# EAGLE design atmega16-128 (EAGLE 9.0.1)
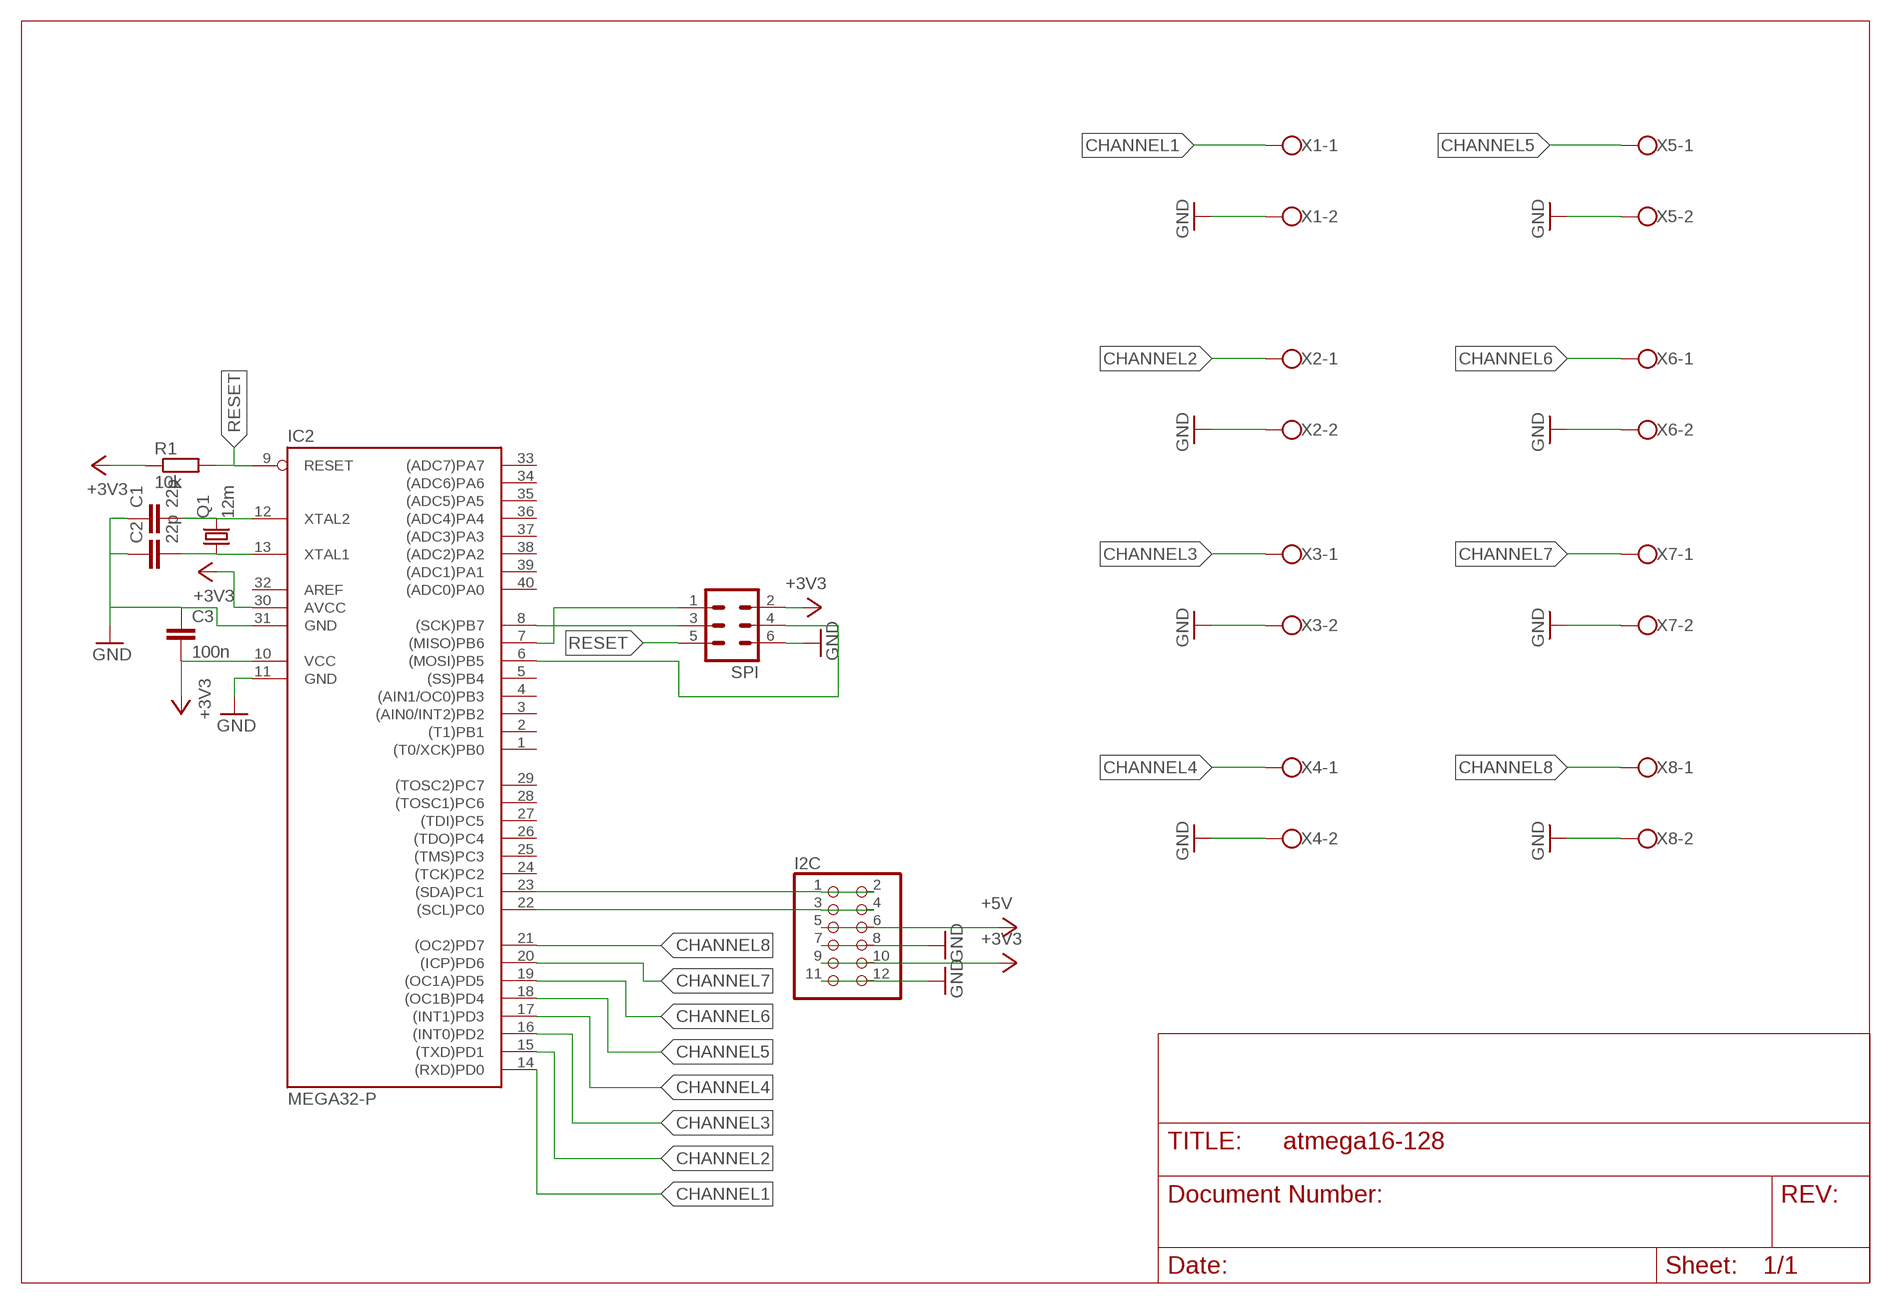
[diagram p0: schematic, sheet 1]

## Parts
C1  22p  C-EU025-025X050  [C025-025X050]
C2  22p  C-EU025-025X050  [C025-025X050]
C3  100n  C-EU025-025X050  [C025-025X050]
I2C  PINHD-2X6  [2X06]
IC2  MEGA32-P  [DIL40]
Q1  12m  CRYSTALHC49S  [HC49/S]
R1  10k  R-EU_0207/10  [0207/10]
SPI  ML6  [ML6]
X1  W237-102  [W237-102]
X2  W237-102  [W237-102]
X3  W237-102  [W237-102]
X4  W237-102  [W237-102]
X5  W237-102  [W237-102]
X6  W237-102  [W237-102]
X7  W237-102  [W237-102]
X8  W237-102  [W237-102]

## Nets
+3V3: C3.2 I2C.9 I2C.10 IC2.10(VCC) IC2.30(AVCC) R1.1 SPI.2
+5V: I2C.5 I2C.6
CHANNEL1: IC2.14((RXD)PD0) X1.1
CHANNEL2: IC2.15((TXD)PD1) X2.1
CHANNEL3: IC2.16((INT0)PD2) X3.1
CHANNEL4: IC2.17((INT1)PD3) X4.1
CHANNEL5: IC2.18((OC1B)PD4) X5.1
CHANNEL6: IC2.19((OC1A)PD5) X6.1
CHANNEL7: IC2.20((ICP)PD6) X7.1
CHANNEL8: IC2.21((OC2)PD7) X8.1
GND: C1.1 C2.1 C3.1 I2C.7 I2C.8 I2C.11 I2C.12 IC2.11(GND) IC2.31(GND) SPI.6 X1.2 X2.2 X3.2 X4.2 X5.2 X6.2 X7.2 X8.2
IO14: IC2.6((MOSI)PB5) SPI.4
N$4: IC2.8((SCK)PB7) SPI.3
N$6: IC2.7((MISO)PB6) SPI.1
RESET: IC2.9(RESET) R1.2 SPI.5
SCL: I2C.3 I2C.4 IC2.22((SCL)PC0)
SDA: I2C.1 I2C.2 IC2.23((SDA)PC1)
XTAL1: C2.2 IC2.13(XTAL1) Q1.1
XTAL2: C1.2 IC2.12(XTAL2) Q1.2
Unconnected: IC2.1((T0/XCK)PB0) IC2.2((T1)PB1) IC2.3((AIN0/INT2)PB2) IC2.4((AIN1/OC0)PB3) IC2.5((SS)PB4) IC2.24((TCK)PC2) IC2.25((TMS)PC3) IC2.26((TDO)PC4) IC2.27((TDI)PC5) IC2.28((TOSC1)PC6) IC2.29((TOSC2)PC7) IC2.32(AREF) IC2.33((ADC7)PA7) IC2.34((ADC6)PA6) IC2.35((ADC5)PA5) IC2.36((ADC4)PA4) IC2.37((ADC3)PA3) IC2.38((ADC2)PA2) IC2.39((ADC1)PA1) IC2.40((ADC0)PA0)

## Library data of the parts
C1-C3 = rcl:C-EU: CAPACITOR, European symbol
I2C = pinhead:PINHD-2X6: PIN HEADER
IC2 = atmel:MEGA32-P: MICROCONTROLLER 32 Kbytes FLASH 2 Kbytes SRAM 1 Kbytes EEPROM USART 8-channel 10 bit ADC Source: www.atmel.com .. doc2503.pdf; MPN: ATMEGA32-16PU; OC_FARNELL: 1661729; OC_NEWARK: 51P1794
Q1 = crystal:CRYSTAL: CRYSTAL; OC_FARNELL: 1667008; OC_NEWARK: unknown
R1 = resistor:R-EU_: RESISTOR, European symbol
SPI = con-ml:ML6: HARTING; OC_FARNELL: unknown; OC_NEWARK: unknown
X1-X8 = con-wago-500:W237-102: WAGO SCREW CLAMP; MPN: 237-102; OC_FARNELL: unknown; OC_NEWARK: 70K9898

## Board
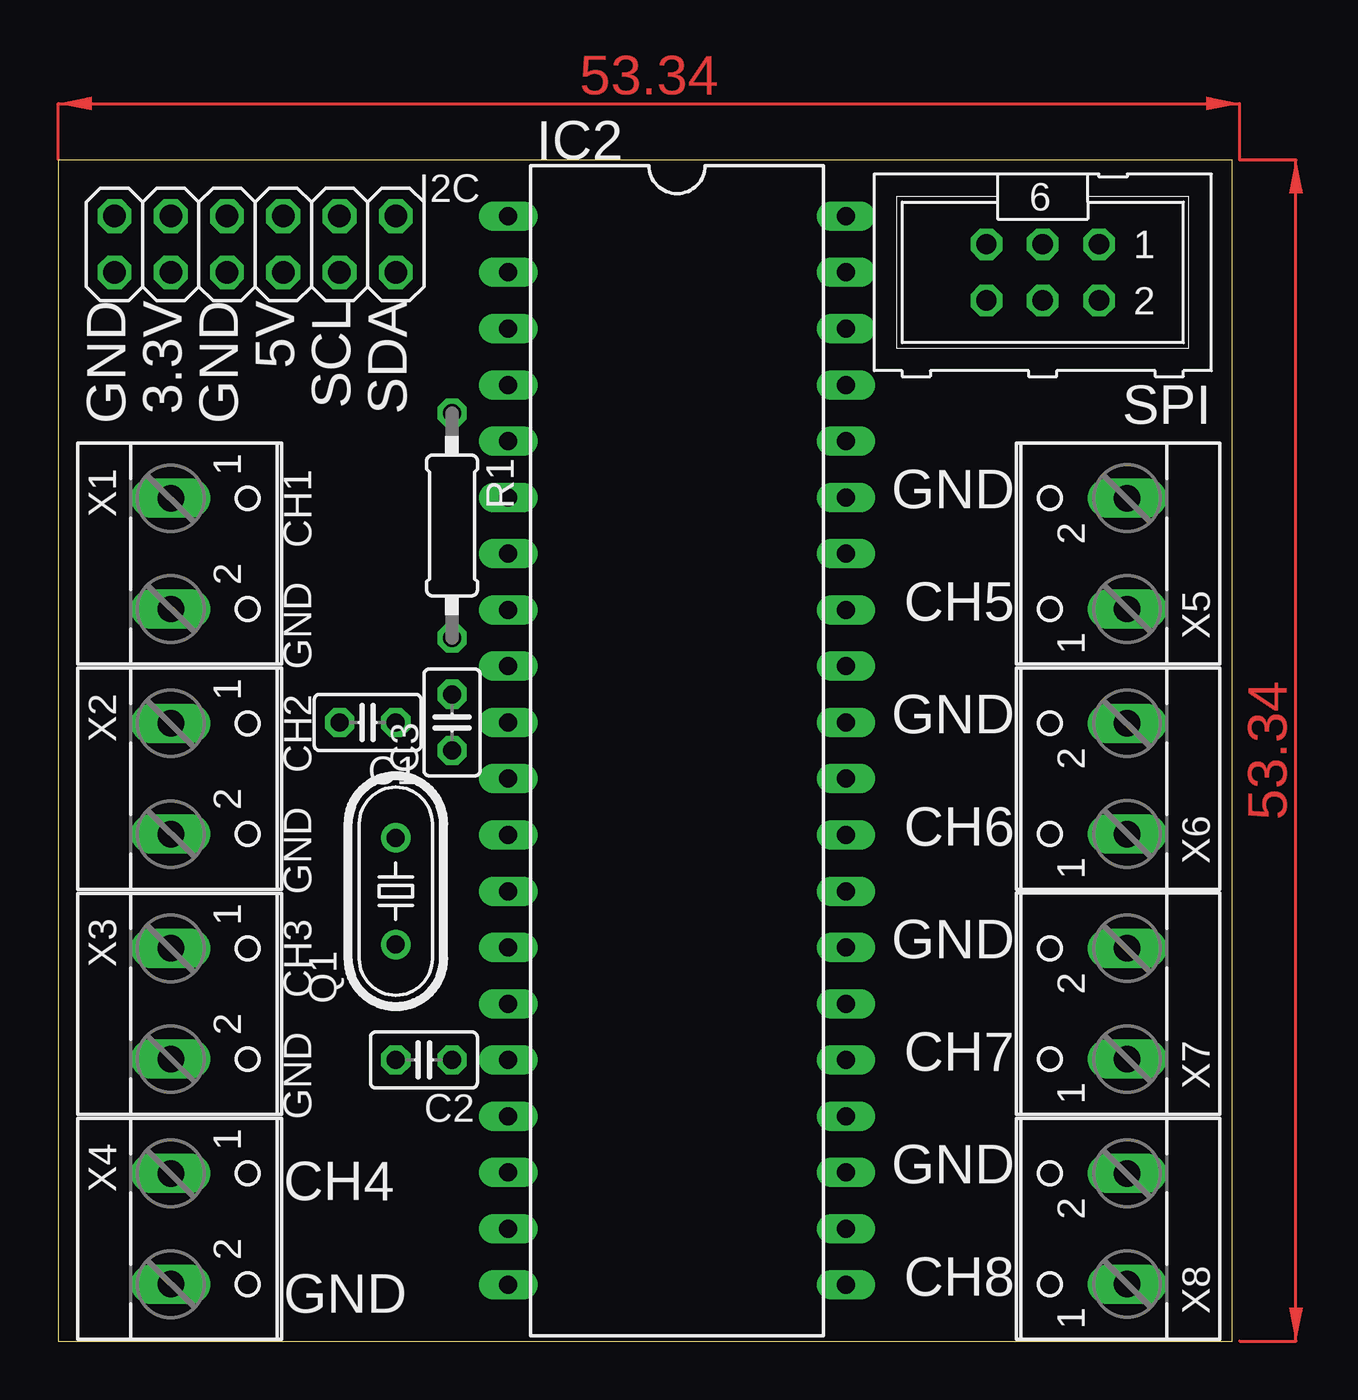
[diagram p1: board, top side]
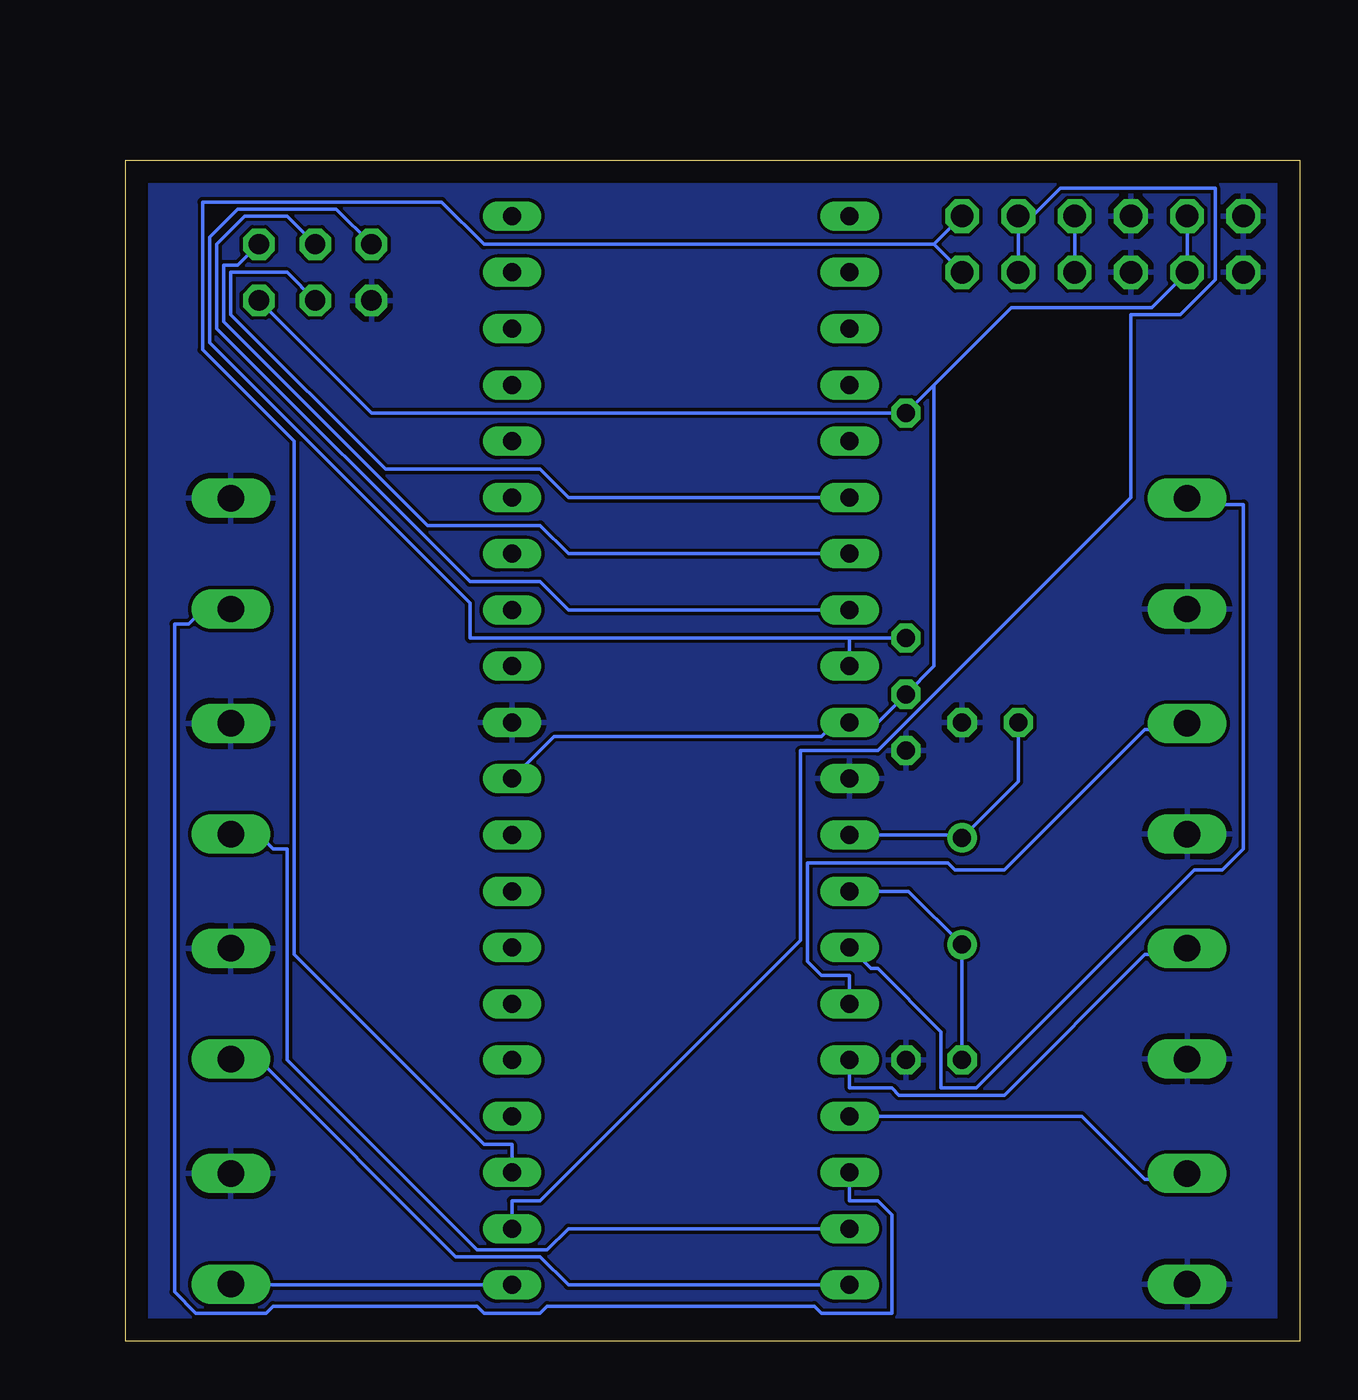
[diagram p2: board, bottom side, seen from below]

Size 53.01 x 53.33 mm. Coordinates in mm from the lower left corner, seen from the top.
Outline: 0,0 53.01,0 53.01,53.33 0,53.33 0,0
Copper layers (1*16): Top 0.035mm / dielectric 1.5mm / Bottom 0.035mm
Design rules "default": minimum track width 6mil, minimum drill 0.35mm, track to track 6mil, track to pad 6mil, pad to pad 6mil, via to via 6mil, smd to smd 6mil, copper to edge 40mil, drill to drill 6mil, minimum pad ring 10mil, minimum via ring 8mil, stop-mask expansion 4mil, vias tented up to drill 0mil, thermal gap 10mil

### Footprints (pad centres in the part's own frame; a part is rotated, then mirrored left to right if it is on the bottom)
C025-025X050 = drill 0.813 octagon: 1 -1.27,0; 2 1.27,0
2X06 = drill 1.016 octagon: 1 -6.35,-1.27; 2 -6.35,1.27; 3 -3.81,-1.27; 4 -3.81,1.27; 5 -1.27,-1.27; 6 -1.27,1.27; 7 1.27,-1.27; 8 1.27,1.27; 9 3.81,-1.27; 10 3.81,1.27; 11 6.35,-1.27; 12 6.35,1.27
DIL40 = drill 0.813 long: 1 -24.13,-7.62; 2 -21.59,-7.62; 3 -19.05,-7.62; 4 -16.51,-7.62; 5 -13.97,-7.62; 6 -11.43,-7.62; 7 -8.89,-7.62; 8 -6.35,-7.62; 9 -3.81,-7.62; 10 -1.27,-7.62; 11 1.27,-7.62; 12 3.81,-7.62; 13 6.35,-7.62; 14 8.89,-7.62; 15 11.43,-7.62; 16 13.97,-7.62; 17 16.51,-7.62; 18 19.05,-7.62; 19 21.59,-7.62; 20 24.13,-7.62; 21 24.13,7.62; 22 21.59,7.62; 23 19.05,7.62; 24 16.51,7.62; 25 13.97,7.62; 26 11.43,7.62; 27 8.89,7.62; 28 6.35,7.62; 29 3.81,7.62; 30 1.27,7.62; 31 -1.27,7.62; 32 -3.81,7.62; 33 -6.35,7.62; 34 -8.89,7.62; 35 -11.43,7.62; 36 -13.97,7.62; 37 -16.51,7.62; 38 -19.05,7.62; 39 -21.59,7.62; 40 -24.13,7.62
HC49/S = drill 0.813: 1 -2.413,0; 2 2.413,0
0207/10 = drill 0.813 octagon: 1 -5.08,0; 2 5.08,0
ML6 = drill 0.914 octagon: 1 -2.54,-1.27; 2 -2.54,1.27; 3 0,-1.27; 4 0,1.27; 5 2.54,-1.27; 6 2.54,1.27
W237-102 = drill 1.194 long: 1 -2.5,-1.27; 2 2.5,-1.27

### Placement (x,y rotation side)
C1  13.97,27.94 180 top
C2  16.51,12.7 180 top
C3  17.78,27.94 90 top
I2C  8.89,49.53 180 top
IC2  27.94,26.67 270 top
Q1  15.24,20.32 90 top
R1  17.78,36.83 270 top
SPI  44.45,48.26 180 top
X1  6.35,35.56 270 top
X2  6.35,25.4 270 top
X3  6.35,15.24 270 top
X4  6.35,5.08 270 top
X5  46.99,35.56 90 top
X6  46.99,25.4 90 top
X7  46.99,15.24 90 top
X8  46.99,5.08 90 top

### Tracks (layer width: path | path; a pad name or v marks a point on that pad's centre or on a via)
+3V3
  Bottom 0.152: IC2.30 33.66,27.31 21.59,27.31 20.96,27.94 IC2.10 19.05,27.94 C3.2 16.51,30.48 16.51,43.18 | 16.51,43.18 13.02,46.67 6.67,46.67 I2C.10 I2C.9 | 16.51,43.18 R1.1 41.91,41.91 SPI.2
+5V
  Bottom 0.152: I2C.5 I2C.6
CHANNEL1
  Bottom 0.152: IC2.14 19.37,16.83 19.05,16.83 16.19,13.97 16.19,11.43 14.61,11.43 4.76,21.27 3.49,21.27 2.54,22.22 2.54,37.78 5.08,37.78 X1.1
CHANNEL2
  Bottom 0.152: IC2.15 20.32,16.51 21.59,16.51 22.22,17.14 22.22,21.59 15.88,21.59 15.56,21.27 13.33,21.27 6.98,27.62 5.08,27.62 X2.1
CHANNEL3
  Bottom 0.152: IC2.16 20.32,11.43 18.42,11.43 18.1,11.11 13.33,11.11 6.98,17.46 5.08,17.46 X3.1
CHANNEL4
  Bottom 0.152: IC2.17 9.84,10.16 6.98,7.3 5.08,7.3 X4.1
CHANNEL5
  Bottom 0.152: IC2.18 20.32,6.35 19.05,6.35 18.42,5.71 18.42,1.27 21.59,1.27 21.91,1.59 33.97,1.59 34.29,1.27 36.83,1.27 37.15,1.59 46.35,1.59 46.67,1.27 49.85,1.27 50.8,2.22 50.8,32.39 50.16,32.39 49.53,33.02 48.26,33.02 X5.1
CHANNEL6
  Bottom 0.152: IC2.19 33.02,5.08 33.97,4.13 37.15,4.13 45.72,12.7 45.72,22.22 46.35,22.22 46.99,22.86 48.26,22.86 X6.1
CHANNEL7
  Bottom 0.152: IC2.20 33.02,2.54 34.29,3.81 38.1,3.81 46.99,12.7 48.26,12.7 X7.1
CHANNEL8
  Bottom 0.152: IC2.21 48.26,2.54 X8.1
GND
  pour Bottom: 0,53.34 53.34,53.34 53.34,0 0,0
  pour Bottom: -1.27,54.61 54.61,54.61 54.61,-1.27 -1.27,-1.27
IO14
  Bottom 0.152: IC2.6 33.02,38.1 34.29,39.37 41.28,39.37 48.26,46.36 48.26,48.26 45.72,48.26 SPI.4
N$4
  Bottom 0.152: IC2.8 33.02,33.02 34.29,34.29 37.47,34.29 48.89,45.72 48.89,49.53 47.62,50.8 45.72,50.8 SPI.3
N$6
  Bottom 0.152: IC2.7 33.02,35.56 34.29,36.83 39.37,36.83 48.58,46.04 48.58,48.58 47.94,48.58 SPI.1
RESET
  Bottom 0.152: 20.32,31.75 IC2.9 | R1.2 20.32,31.75 | SPI.5 43.5,51.12 47.94,51.12 49.21,49.85 49.21,45.09 37.47,33.34 37.47,31.75 20.32,31.75
SCL
  Bottom 0.152: IC2.22 35.56,6.35 34.29,6.35 22.54,18.1 22.54,26.67 19.05,26.67 7.62,38.1 7.62,46.36 5.4,46.36 3.81,47.94 3.81,52.07 10.79,52.07 12.07,50.8 I2C.3 I2C.4
SDA
  Bottom 0.152: IC2.23 35.56,8.89 36.83,8.89 45.4,17.46 45.4,40.64 49.53,44.77 49.53,51.44 38.73,51.44 36.83,49.53 16.51,49.53 | I2C.1 16.51,49.53 | 16.51,49.53 I2C.2
XTAL1
  Bottom 0.152: IC2.13 17.65,20.32 Q1.1 C2.2
XTAL2
  Bottom 0.152: IC2.12 15.37,22.86 Q1.2 12.7,25.27 C1.2
(copper drawn outside any net)
  shapes: Top area x2

### Text on the board
tNames: GND | 3.3V | GND | 5V | SCL | SDA | CH1 | GND | GND | CH5 | CH2 | GND | GND | CH6 | CH3 | GND | GND | CH7 | GND | CH4 | CH8 | GND